# EAGLE design ArmRobot (EAGLE 8.3.2)
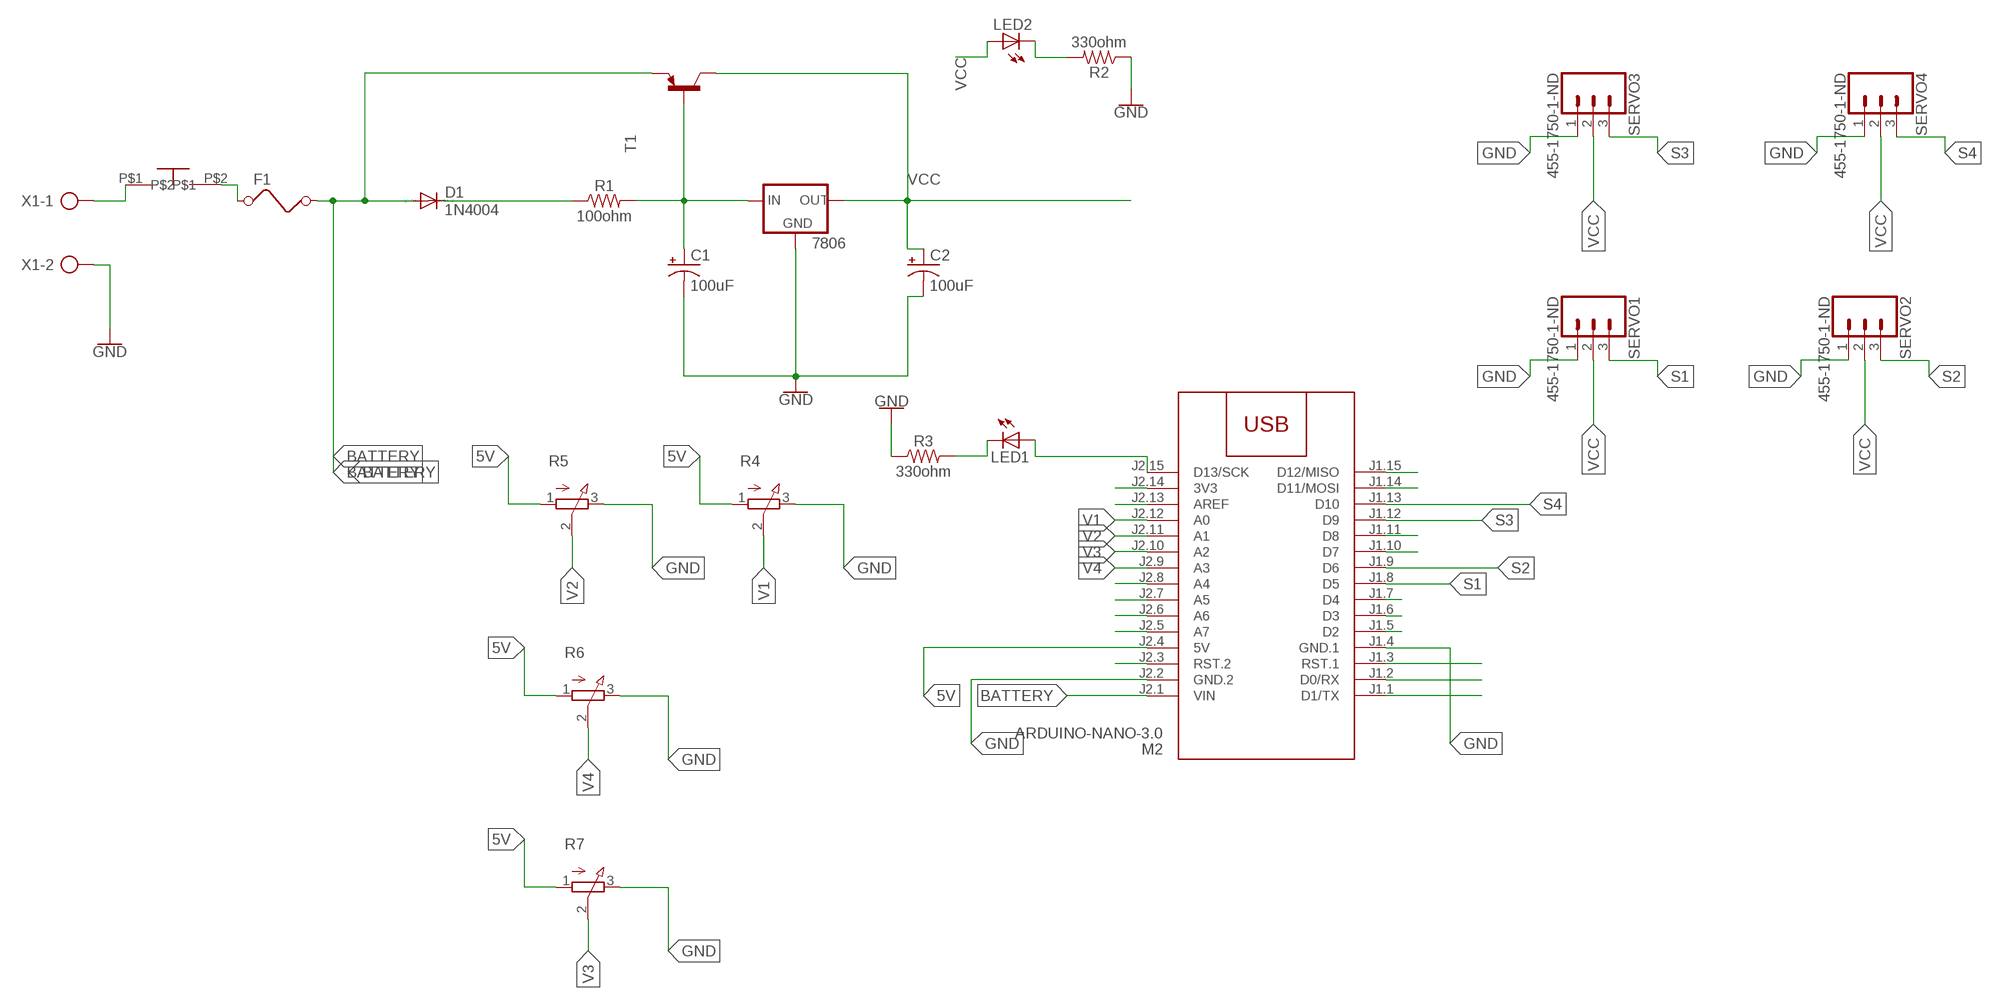
[diagram p0: schematic, sheet 1]

## Parts
7806  78XXS  [78XXS]
C1  100uF  100UF-POLAR-RADIAL-2.5MM-25V-20%  [CPOL-RADIAL-2.5MM-6.5MM]
C2  100uF  100UF-POLAR-RADIAL-2.5MM-25V-20%  [CPOL-RADIAL-2.5MM-6.5MM]
D1  1N4004  [DO41-10]
F1  FUSE  [FUSE]
LED1  LED3MM  [LED3MM]
LED2  LED3MM  [LED3MM]
M2  ARDUINO-NANO-3.0  [ARDUINO-NANO-3.0]
R1  100ohm  10MOHM-HORIZ-1/4W-5%  [AXIAL-0.3]
R2  330ohm  10MOHM-HORIZ-1/4W-5%  [AXIAL-0.3]
R3  330ohm  10MOHM-HORIZ-1/4W-5%  [AXIAL-0.3]
R4  3RP/1610N  [3RP/1610N]
R5  3RP/1610N  [3RP/1610N]
R6  3RP/1610N  [3RP/1610N]
R7  3RP/1610N  [3RP/1610N]
SERVO1  455-1750-1-ND  CONN_03  [1X03]
SERVO2  455-1750-1-ND  CONN_03  [1X03]
SERVO3  455-1750-1-ND  CONN_03  [1X03]
SERVO4  455-1750-1-ND  CONN_03  [1X03]
T1  -PNP-TO220V  [TO220V]
U$1  ON_OFF  [ON_OFF]
X1  AK500/2-H  [AK500/2-H]

## Nets
5V: M2.J2.4(5V) R4.1(A) R5.1(A) R6.1(A) R7.1(A)
BATTERY: D1.A F1.2 M2.J2.1(VIN) T1.3(E)
BATTERY_INPUT: U$1.P$1 X1.1
GND: 7806.GND C1.2(-) C2.2(-) M2.J1.4(GND.1) M2.J2.2(GND.2) R2.P$1 R3.P$1 R4.3(E) R5.3(E) R6.3(E) R7.3(E) SERVO1.1 SERVO2.1 SERVO3.1 SERVO4.1 X1.2
N$1: LED1.K(C) R3.P$2
N$2: LED1.A M2.J2.15(D13/SCK)
N$3: D1.C R1.P$1
N$4: 7806.IN C1.1(+) R1.P$2 T1.1(B)
N$5: F1.1 U$1.P$2
N$6: LED2.K(C) R2.P$2
N$7: M2.J2.3(RST.2)
N$9: M2.J2.5(A7)
N$10: M2.J2.6(A6)
N$11: M2.J2.7(A5)
N$12: M2.J2.8(A4)
N$17: M2.J2.13(AREF)
N$18: M2.J2.14(3V3)
N$19: M2.J1.15(D12/MISO)
N$20: M2.J1.14(D11/MOSI)
N$21: M2.J1.11(D8)
N$22: M2.J1.10(D7)
N$23: M2.J1.7(D4)
N$24: M2.J1.6(D3)
N$25: M2.J1.5(D2)
N$26: M2.J1.3(RST.1)
N$27: M2.J1.2(D0/RX)
N$28: M2.J1.1(D1/TX)
S1: M2.J1.8(D5) SERVO1.3
S2: M2.J1.9(D6) SERVO2.3
S3: M2.J1.12(D9) SERVO3.3
S4: M2.J1.13(D10) SERVO4.3
V1: M2.J2.12(A0) R4.2(S)
V2: M2.J2.11(A1) R5.2(S)
V3: M2.J2.10(A2) R7.2(S)
V4: M2.J2.9(A3) R6.2(S)
VCC: 7806.OUT C2.1(+) LED2.A SERVO1.2 SERVO2.2 SERVO3.2 SERVO4.2 T1.2(C)

## Library data of the parts
7806 = v-reg:78XXS: VOLTAGE REGULATOR
C1 C2 = SparkFun-Capacitors:100UF-POLAR: 100µF polarized capacitors A capacitor is a passive two-terminal electrical component used to store electrical energy temporarily in an electric field.; PROD_ID: CAP-08439
D1 = diode:1N4004: DIODE general purpose rectifier, 1 A
F1 = special:FUSE: FUSE 5 x 20 mm
LED1 LED2 = led:LED: LED OSRAM: - CHIPLED LG R971, LG N971, LY N971, LG Q971, LY Q971, LO R971, LY R971 LH N974, LH R974 LS Q976, LO Q976, LY Q976 LO Q996 - Hyper CHIPLED LW Q18S LB Q993, LB Q99A, LB R99A - SideLED LS A670, LO A670, LY A670, LG A670, LP A670 LB A673, LV A673, LT A673, LW A673 LH A674 LY A675 LS A676, LA A676, LO A676, LY A676, LW A676 LS A679, LY A679, LG A679 - Hyper Micro SIDELED® LS Y876, LA Y876, LO Y876, LY Y876 LT Y87S - SmartLED LW L88C, LW L88S LB L89C, LB L89S, LG L890 LS L89K, LO L89K, LY L89K LS L896, LA L896, LO L896, LY L896 - TOPLED LS T670, LO T670, LY T670, LG T670, LP T670 LSG T670, LSP T670, LSY T670, LOP T670, LYG T670 LG T671, LOG T671, LSG T671 LB T673, LV T673, LT T673, LW T673 LH T674 LS T676, LA T676, LO T676, LY T676, LB T676, LH T676, LSB T676, LW T676 LB T67C, LV T67C, LT T67C, LS T67K, LO T67K, LY T67K, LW E67C LS E67B, LA E67B, LO E67B, LY E67B, LB E67C, LV E67C, LT E67C LW T67C LS T679, LY T679, LG T679 LS T770, LO T770, LY T770, LG T770, LP T770 LB T773, LV T773, LT T773, LW T773 LH T774 LS E675, LA E675, LY E675, LS T675 LS T776, LA T776, LO T776, LY T776, LB T776 LHGB T686 LT T68C, LB T68C - Hyper Mini TOPLED® LB M676 - Mini TOPLED Santana® LG M470 LS M47K, LO M47K, LY M47K Source: http://www.osram.convergy.de LUXEON: - LUMILED® LXK2-PW12-R00, LXK2-PW12-S00, LXK2-PW14-U00, LXK2-PW14-V00 LXK2-PM12-R00, LXK2-PM12-S00, LXK2-PM14-U00 LXK2-PE12-Q00, LXK2-PE12-R00, LXK2-PE12-S00, LXK2-PE14-T00, LXK2-PE14-U00 LXK2-PB12-K00, LXK2-PB12-L00, LXK2-PB12-M00, LXK2-PB14-N00, LXK2-PB14-P00, LXK2-PB14-Q00 LXK2-PR12-L00, LXK2-PR12-M00, LXK2-PR14-Q00, LXK2-PR14-R00 LXK2-PD12-Q00, LXK2-PD12-R00, LXK2-PD12-S00 LXK2-PH12-R00, LXK2-PH12-S00 LXK2-PL12-P00, LXK2-PL12-Q00, LXK2-PL12-R00 Source: www.luxeon.com KINGBRIGHT: KA-3528ASYC Source: www.kingbright.com
M2 = diy-modules:ARDUINO-NANO-3.0: Arduino Nano 3.0 and compatible devices More details available here: https://www.arduino.cc/en/Main/ArduinoBoardNano Click here to find device on ebay.com <http://www.ebay.com/sch/arduino+nano>
R1-R3 = SparkFun-Resistors:10MOHM: RES-09327; PROD_ID: RES-09327; VALUE: 10M
R4-R7 = pot:3RP/1610N: 16mm Potentiometer one level Source: http://www.alphapotentiometers.net/html/16mm_pot_2.html
SERVO1-SERVO4 = SparkFun-Connectors:CONN_03: Multi connection point. Often used as Generic Header-pin footprint for 0.1 inch spaced/style header connections On any of the 0.1 inch spaced packages, you can populate with these: Break Away Headers - Straight <https://www.sparkfun.com/products/116> (PRT-00116) Break Away Male Headers - Right Angle <https://www.sparkfun.com/products/553> (PRT-00553) Female Headers <https://www.sparkfun.com/products/115> (PRT-00115) Break Away Headers - Machine Pin <https://www.sparkfun.com/products/117> (PRT-00117) Break Away Female Headers - Swiss Machine Pin <https://www.sparkfun.com/products/743> (PRT-00743) Stackable Header - 3 Pin (Female, 0.1") <https://www.sparkfun.com/products/13875> (PRT-13875) For SCREWTERMINALS and SPRING TERMINALS visit here: Screw Terimnals on SparkFun.com <https://www.sparkfun.com/search/results?term=Screw+Terminals> (5mm/3.5mm/2.54mm spacing) This device is also useful as a general connection point to wire up your design to another part of your project. Our various solder wires solder well into these plated through hole pads. Hook-Up Wire - Assortment (Stranded, 22 AWG) <https://www.sparkfun.com/products/11375> (PRT-11375) Hook-Up Wire - Assortment (Solid Core, 22 AWG) <https://www.sparkfun.com/products/11367> (PRT-11367) View the entire wire category on our website here <https://www.sparkfun.com/categories/141> Special notes: Molex polarized connector foot print use with SKU : PRT-08232 with associated crimp pins and housings.; PROD_ID: XXX-00000
T1 = transistor:*-PNP-: PNP Transistror
U$1 = ON_OFF:ON_OFF
X1 = con-ptr500:AK500/2-H: CONNECTOR Aug. 2004 / PTR Meßtechnik: Die Bezeichnung der Serie AK505 wurde geändert. Es handelt sich hierbei um AK500 in horizontaler Ausführung.; OC_FARNELL: unknown; OC_NEWARK: unknown

## Board
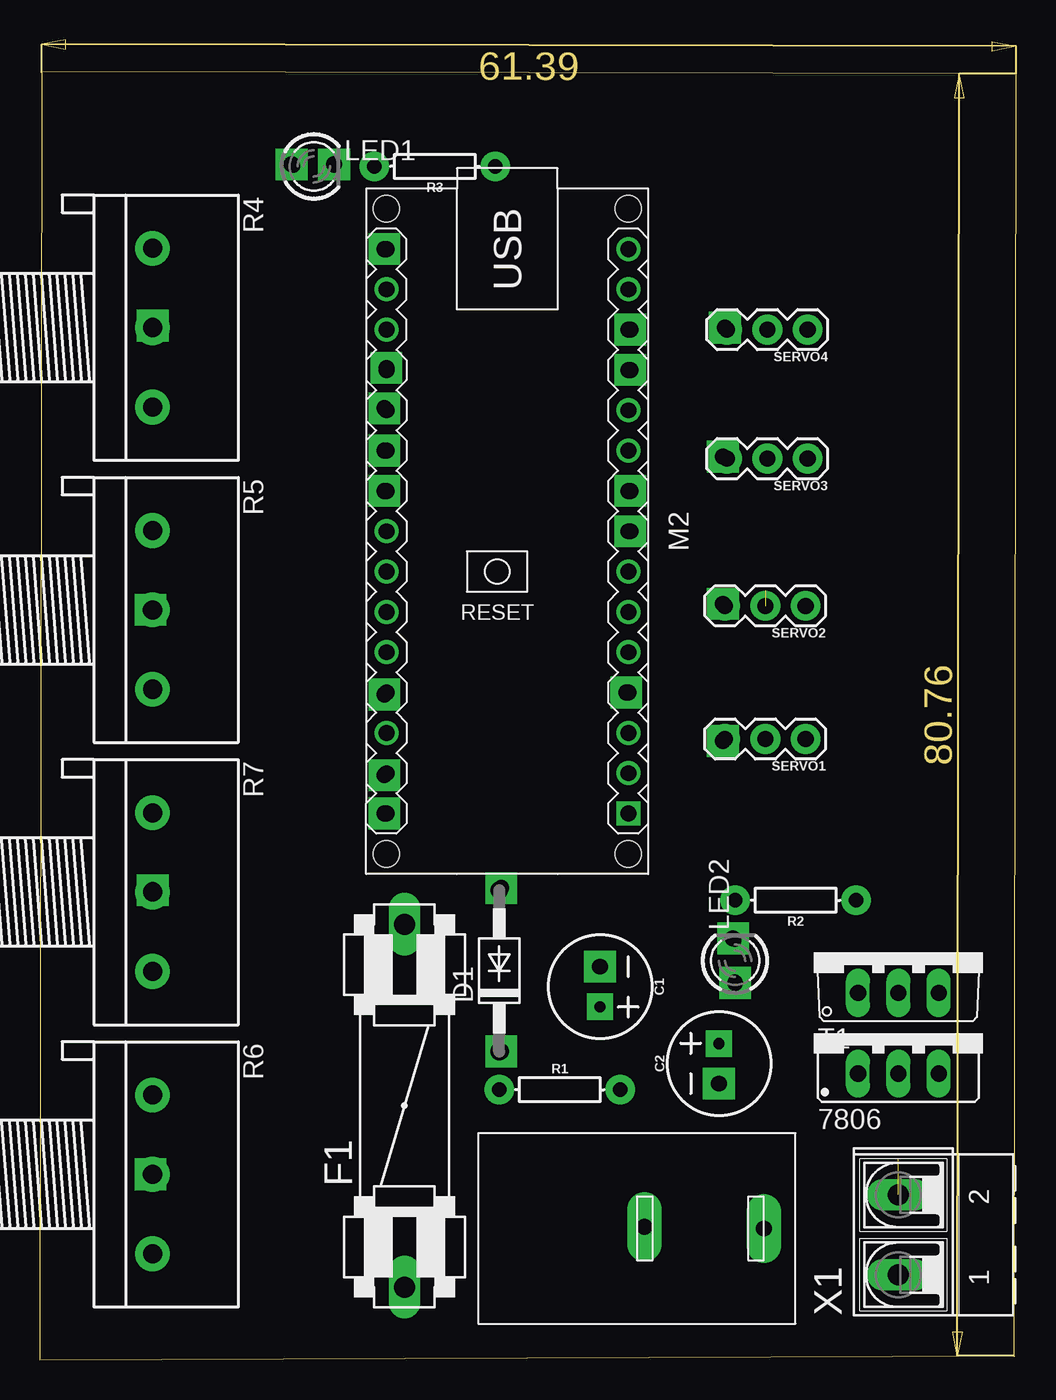
[diagram p1: board, top side]
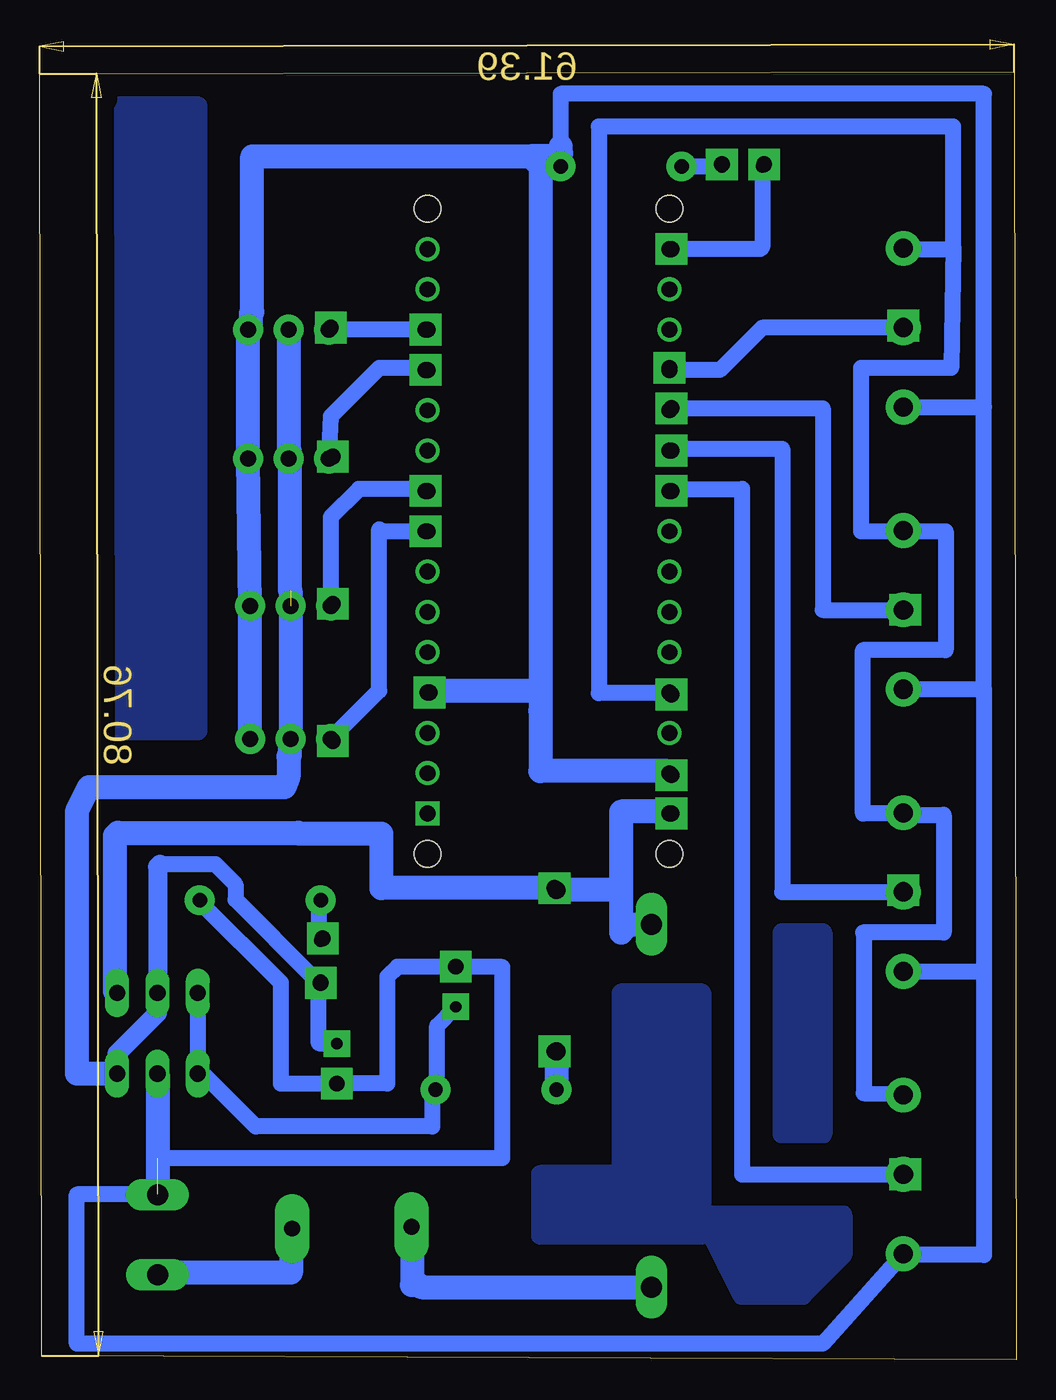
[diagram p2: board, bottom side, seen from below]

Size 61.52 x 81.14 mm. Coordinates in mm from the lower left corner, seen from the top.
Outline: 0,0 61.39,0.25 61.52,81.02 0.13,81.14 0,0
Copper layers (1*16): Top 0.035mm / dielectric 1.5mm / Bottom 0.035mm
Design rules "default *": minimum track width 1mm, minimum drill 0.35mm, track to track 0.6mm, track to pad 0.8mm, pad to pad 6mil, via to via 6mil, smd to smd 6mil, copper to edge 40mil, drill to drill 6mil, minimum pad ring 10mil, minimum via ring 8mil, stop-mask expansion 4mil, vias tented up to drill 0mil, thermal gap 10mil

### Footprints (pad centres in the part's own frame; a part is rotated, then mirrored left to right if it is on the bottom)
78XXS = drill 1.016 long: GND 0,-2.54; IN -2.54,-2.54; OUT 2.54,-2.54
CPOL-RADIAL-2.5MM-6.5MM = drill 0.7 pad 1.651 square: 1 1.25,0 | drill 0.7 pad 1.651: 2 -1.25,0
DO41-10 = drill 1.118: A 5.08,0; C -5.08,0
FUSE = drill 1.321 long: 1 -11.43,0; 2 11.43,0
LED3MM = drill 0.813 octagon: A -1.27,0; K 1.27,0
ARDUINO-NANO-3.0 = drill 1 square: J1.1 17.78,7.62 | drill 1: J1.2 15.24,7.62; J1.3 12.7,7.62; J1.4 10.16,7.62; J1.5 7.62,7.62; J1.6 5.08,7.62; J1.7 2.54,7.62; J1.8 0,7.62; J1.9 -2.54,7.62; J1.10 -5.08,7.62; J1.11 -7.62,7.62; J1.12 -10.16,7.62; J1.13 -12.7,7.62; J1.14 -15.24,7.62; J1.15 -17.78,7.62; J2.1 17.78,-7.62; J2.2 15.24,-7.62; J2.3 12.7,-7.62; J2.4 10.16,-7.62; J2.5 7.62,-7.62; J2.6 5.08,-7.62; J2.7 2.54,-7.62; J2.8 0,-7.62; J2.9 -2.54,-7.62; J2.10 -5.08,-7.62; J2.11 -7.62,-7.62; J2.12 -10.16,-7.62; J2.13 -12.7,-7.62; J2.14 -15.24,-7.62; J2.15 -17.78,-7.62 | hole 1.651: -20.32,7.62; -20.32,-7.62; 20.32,-7.62; 20.32,7.62
AXIAL-0.3 = drill 0.9 pad 1.88: P$1 -3.81,0; P$2 3.81,0
3RP/1610N = drill 1.2 pad 2.184: 1 -5,0; 2 0,0; 3 5,0
1X03 = drill 1.016 pad 1.88: 1 0,0; 2 2.54,0; 3 5.08,0
TO220V = drill 1.016 long: 1 -2.54,-2.54; 2 0,-2.54; 3 2.54,-2.54
ON_OFF = drill 1 pad 2.184 long: P$1 2,9; P$2 9.525,8.89
AK500/2-H = drill 1.321 long: 1 -2.515,0; 2 2.515,0

### Placement (x,y rotation side)
7806  54.1,20.57 0 top
C1  35.31,23.5 270 top
C2  42.8,18.67 90 top
D1  28.96,24.51 90 top
F1  22.99,16 90 top
LED1  17.27,75.18 0 top
LED2  43.81,25.15 90 top
M2  29.46,52.2 270 top
R1  32.77,17.02 0 top
R2  47.62,28.96 180 top
R3  24.89,75.18 180 top
R4  7.11,65.02 270 top
R5  7.11,47.24 270 top
R6  7.11,11.68 270 top
R7  7.11,29.46 270 top
SERVO1  48.26,39.12 180 top
SERVO2  48.26,47.5 180 top
SERVO3  48.39,56.77 180 top
SERVO4  48.39,64.9 180 top
T1  54.1,25.65 0 top
U$1  47.62,17.27 180 top
X1  54.1,7.87 90 top

### Tracks (layer width: path | path; a pad name or v marks a point on that pad's centre or on a via)
5V
  Bottom 1: 7.67,52.2 9.78,52.2 9.78,62.48 4.1,62.48 3.97,70.11 | 7.67,52.2 7.24,52.2 R5.1 | R4.1 7.11,69.94 4.14,69.94 3.97,70.11 | 21.72,42 M2.J2.4 | 3.97,70.11 3.97,70.15 3.97,77.69 26.29,77.69 26.29,42 22.35,42 M2.J2.4 | M2.J2.4 21.72,42.16 | R6.1 7.11,16.76 9.6,16.79 9.6,26.87 9.65,26.92 4.57,26.92 4.57,34.34 6.99,34.34 R7.1 | 7.11,34.42 R7.1 | R7.1 7.19,34.42 9.65,34.42 9.65,44.7 4.44,44.7 4.44,52.2 6.94,52.2 R5.1 | R5.1 7.67,52.2
BATTERY  (via drill 1 pad 2)
  Bottom 1.5: M2.J2.1 21.97,34.54 24.89,34.54 24.89,29.46 | 24.89,29.46 24.89,26.92 24.38,27.43 F1.2 | 24.89,29.46 25.02,29.59 D1.A v29.08,29.72 40,29.72 40,33.15 45.17,33.15 45.23,33.21 56.58,33.21 56.77,33.02 56.77,23.24 T1.3
BATTERY_INPUT
  Bottom 1.5: X1.1 53.97,5.49 45.69,5.49 45.69,8.21 U$1.P$1
GND  (1 unrouted)
  Bottom 1: R2.P$1 51.4,28.83 46.32,23.75 46.32,17.4 42.82,17.4 C2.2 39.64,17.42 39.62,17.4 39.62,24.13 38.99,24.77 35.33,24.77 C1.2 32.38,24.75 32.38,12.7 54.1,12.7 | R4.3 2.03,60.02 | 2.03,42.24 2.03,24.46 | 2.03,42.24 2.03,60.02 | 2.03,24.46 2.03,6.6 7.11,6.6 R6.3 12.19,1.02 59.18,1.02 59.18,10.41 54.1,10.41 X1.2 | R7.3 2.03,24.46 | R5.3 2.03,42.24 | 2.03,60.02 2.03,79.76 28.7,79.76 28.7,76.45
  Bottom 1.5: 7806.GND X1.2 | SERVO1.1 SERVO2.1 SERVO3.1 SERVO4.1 48.21,64.95 48.21,65.93 48.13,66 48.13,75.82 30.61,75.82 29.97,75.18 | M2.J2.2 21.97,37.08 29.97,37.08 29.97,40.89 | 29.97,40.89 29.97,42.16 36.96,42.16 M2.J1.4 | 29.97,40.89 | 29.97,75.18 29.97,40.89 | 29.97,75.18 30.61,75.81 28.69,75.82 28.7,76.45 R3.P$1 29.97,75.18
N$1
  Bottom 1: R3.P$2 LED1.K
N$2  (via drill 1 pad 2)
  Bottom 1: LED1.A 16,70.1 16.13,69.98 v21.72,69.98 M2.J2.15
N$3
  Bottom 1.5: D1.C R1.P$1
N$4
  Bottom 1: T1.1 7806.IN 51.09,17.88 47.91,14.7 36.8,14.7 36.8,16.61 R1.P$2 36.48,17.08 36.48,21.05 35.37,22.16 C1.1
N$5
  Bottom 1: 38.07,4.7 37.59,4.7
  Bottom 1.5: U$1.P$2 38.07,8.35 38.07,4.7 | 37.59,4.7 37.46,4.57 F1.1
N$6
  Bottom 1: LED2.K 43.94,26.45 43.94,28.83 R2.P$2
N$8
  pour Bottom: 51.56,39.62 59.18,39.62 59.18,78.99 51.56,78.99
N$13
  pour Bottom: 19.81,23.11 24.89,23.11 24.89,11.68 29.97,11.68 29.97,7.87 19.81,7.87
N$14
  pour Bottom: 19.81,9.14 10.92,9.14 10.92,6.6 13.46,4.06 17.27,4.06
N$15
  pour Bottom: 14.73,26.92 12.19,26.92 12.19,14.22 14.73,14.22
N$16  (via drill 1 pad 2)
  other vias: 37.21,62.36
N$29  (via drill 1 pad 2)
  other vias: 37.21,54.74
N$30  (via drill 1 pad 2)
  other vias: 36.96,42.04
N$31  (via drill 1 pad 2)
  other vias: 29.08,19.43
N$32  (via drill 1 pad 2)
  other vias: 43.69,26.54
N$33  (via drill 1 pad 2)
  other vias: 43.81,23.75
N$34  (via drill 1 pad 2)
  other vias: 21.84,62.48
N$35  (via drill 1 pad 2)
  other vias: 21.72,57.28
N$36  (via drill 1 pad 2)
  other vias: 21.72,54.74
N$37  (via drill 1 pad 2)
  other vias: 21.72,41.91
N$38  (via drill 1 pad 2)
  other vias: 21.72,36.83
N$39  (via drill 1 pad 2)
  other vias: 43.18,65.02
N$40  (via drill 1 pad 2)
  other vias: 43.05,56.9
N$41  (via drill 1 pad 2)
  other vias: 43.05,47.62
N$42  (via drill 1 pad 2)
  other vias: 43.05,38.99
N$43  (via drill 1 pad 2)
  other vias: 15.88,75.31
N$44  (via drill 1 pad 2)
  other vias: 18.54,75.31
N$45  (via drill 1 pad 2)
  other vias: 21.72,34.42
N$46  (via drill 1 pad 2)
  other vias: 42.8,17.4
N$47  (via drill 1 pad 2)
  other vias: 35.31,24.77
N$48  (via drill 1 pad 2)
  other vias: 7.11,65.15
N$49  (via drill 1 pad 2)
  other vias: 6.99,47.24
N$50  (via drill 1 pad 2)
  other vias: 7.11,29.59
N$51  (via drill 1 pad 2)
  other vias: 6.99,11.68
S1  (via drill 1 pad 2)
  Bottom 1: SERVO1.3 40.13,42.16 40.13,52.32 40,52.2 v37.21,52.2 M2.J1.8
S2
  Bottom 1: M2.J1.9 37.21,54.86 41.4,54.86 43.18,53.09 SERVO2.3
S3
  Bottom 1: M2.J1.12 37.21,62.48 40.13,62.48 43.18,59.44 SERVO3.3
S4  (via drill 1 pad 2)
  Bottom 1: M2.J1.13 v37.21,64.9 SERVO4.3
V1
  Bottom 1: R4.2 16,65.02 18.67,62.36 M2.J2.12
V2  (via drill 1 pad 2)
  Bottom 1: M2.J2.11 v21.72,59.94 12.19,59.94 12.19,47.24 R5.2
V3
  Bottom 1: M2.J2.10 21.72,57.4 14.73,57.4 14.73,29.46 R7.2
V4
  Bottom 1: M2.J2.9 21.72,54.86 17.27,54.86 17.27,11.68 R6.2
VCC  (1 unrouted)
  Bottom 1: C2.1 43.94,19.94 43.94,23.75 LED2.A 44.26,24.07 49.18,28.99 49.18,29.94 50.45,31.21 53.94,31.21 | 54.1,21.84 T1.2
  Bottom 1.2: 7806.OUT 56.64,19.3 54.1,21.84 | T1.2 54.1,31.05 53.94,31.21
  Bottom 1.5: SERVO4.2 SERVO3.2 45.77,57.23 45.77,48.51 45.72,48.46 SERVO1.2 45.77,39.07 45.77,38.08 45.85,38.01 45.85,36.7 46.1,36.07 58.42,36.07 59.18,34.54 59.18,18.03 7806.OUT